# Altium project Kasli-DIOT.PrjPCB (part 3 of 7)

## Sheet PowerSupplies.SchDoc: Kasli-DIOT
size 420 x 297 mm; EDA_Number: ARTIQ; Projet: ARTIQ/SINARA; Author: G.Kasprowicz; CompanyName: WUT ISE; DrawnBy: F.Świtakowski; Organization: WUT ISE; Address1: PW ISE; Address2: Nowowiejska 15/19 00-665 Warsaw; Address3: gkasprow@gmail.com; DocumentNumber: 8; Revision: 1.0; SheetNumber: 8; SheetTotal: 16; ModifiedBy: -; CheckedDate: -; Title2: PowerSupplies; DivGrp: WUT ISE; Designer: F.Świtakowski; ModifiedDate: -; ProjectName: Sensor Box
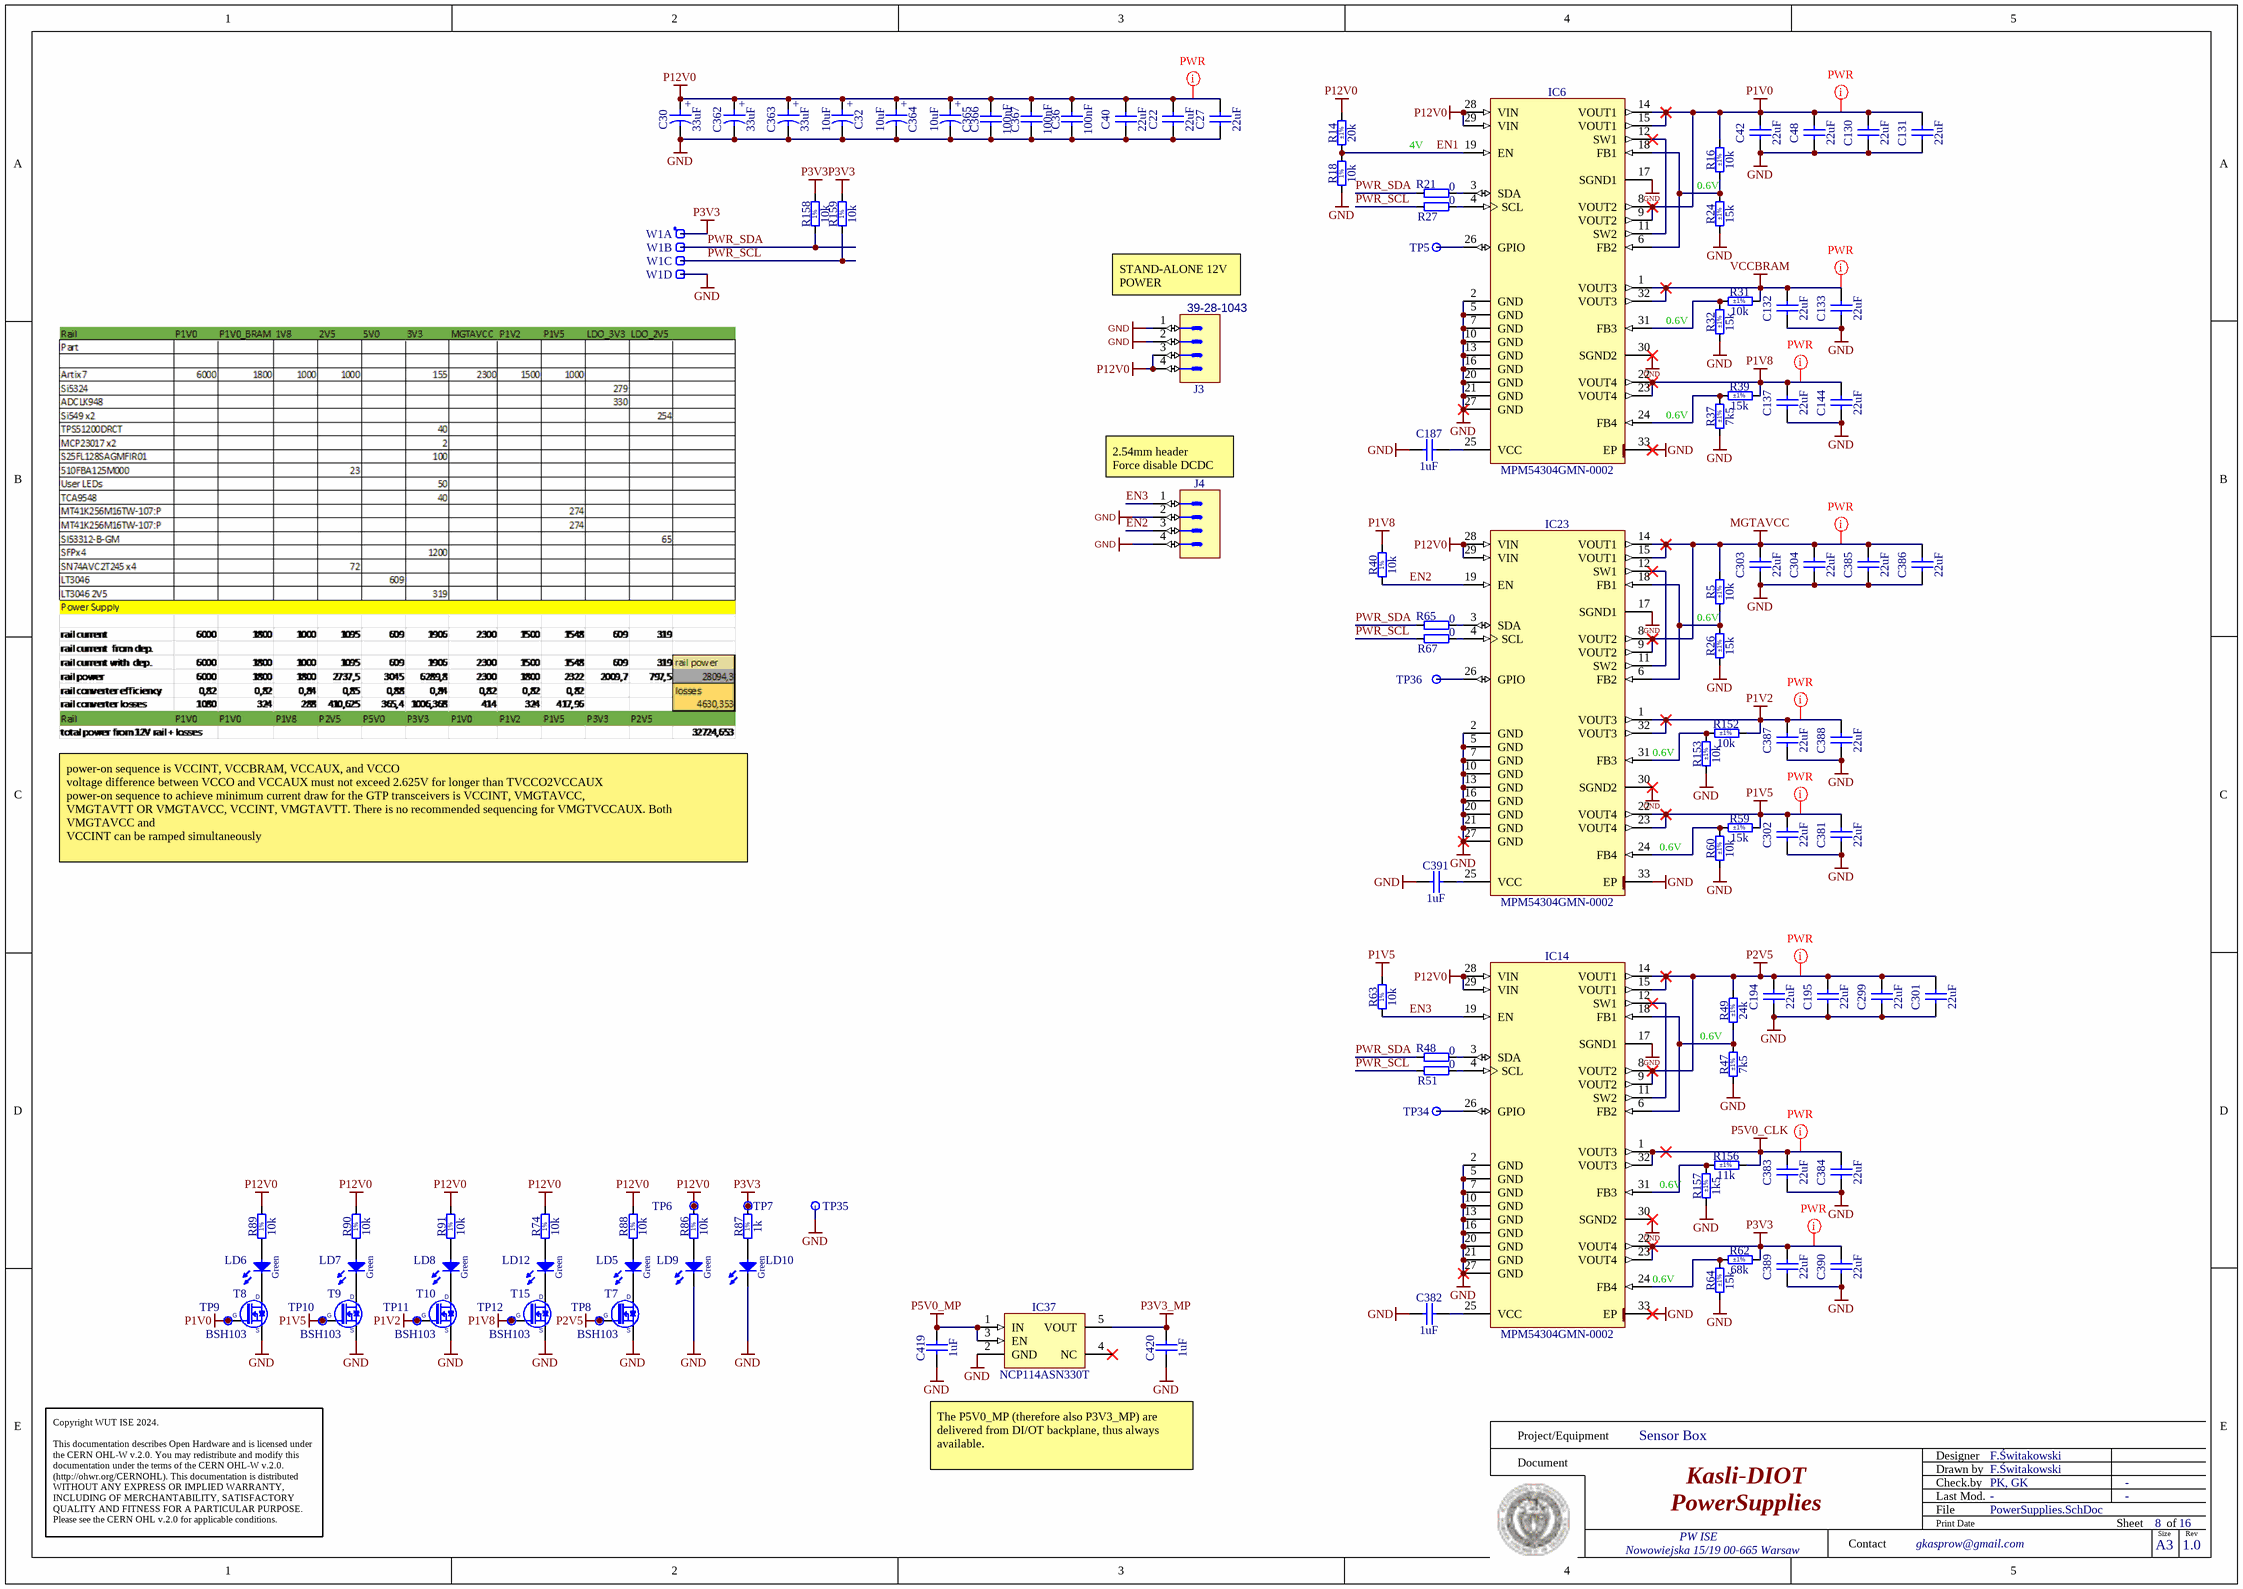
[diagram p2: PowerSupplies.SchDoc]

### Parts
C22  22uF  [CAPC2012X135N]
C27  22uF  [CAPC2012X135N]
C30  33uF  [CAPMP3528X210N]
C32  10uF  [CAPMP3216X180N]
C36  100nF  [CAPC1005X55N]
C40  22uF  [CAPC2012X135N]
C42  22uF  [CAPC2012X135N]
C48  22uF  [CAPC2012X135N]
C130  22uF  [CAPC2012X135N]
C131  22uF  [CAPC2012X135N]
C132  22uF  [CAPC2012X135N]
C133  22uF  [CAPC2012X135N]
C137  22uF  [CAPC2012X135N]
C144  22uF  [CAPC2012X135N]
C187  1uF  [CAPC1608X87N]
C194  22uF  [CAPC2012X135N]
C195  22uF  [CAPC2012X135N]
C299  22uF  [CAPC2012X135N]
C301  22uF  [CAPC2012X135N]
C302  22uF  [CAPC2012X135N]
C303  22uF  [CAPC2012X135N]
C304  22uF  [CAPC2012X135N]
C362  33uF  [CAPMP3528X210N]
C363  33uF  [CAPMP3528X210N]
C364  10uF  [CAPMP3216X180N]
C365  10uF  [CAPMP3216X180N]
C366  100nF  [CAPC1005X55N]
C367  100nF  [CAPC1005X55N]
C381  22uF  [CAPC2012X135N]
C382  1uF  [CAPC1608X87N]
C383  22uF  [CAPC2012X135N]
C384  22uF  [CAPC2012X135N]
C385  22uF  [CAPC2012X135N]
C386  22uF  [CAPC2012X135N]
C387  22uF  [CAPC2012X135N]
C388  22uF  [CAPC2012X135N]
C389  22uF  [CAPC2012X135N]
C390  22uF  [CAPC2012X135N]
C391  1uF  [CAPC1608X87N]
C419  1uF  [CAPC1608X87N]
C420  1uF  [CAPC1608X87N]
IC6  MPM54304GMN-0002  [MPS_MPM54304GMN]
IC14  MPM54304GMN-0002  [MPS_MPM54304GMN]
IC23  MPM54304GMN-0002  [MPS_MPM54304GMN]
IC37  NCP114ASN330T  [SOT95P280X100-5N]
J3  Manufacturer Part Number: 39-28-1043  [MOLEX_39-28-1043]  (hidden comment: Mini-Fit Jr.™)
J4  Header 2  [SAMTEC_TSM-102-01-L-DV]  (value not drawn)
LD5  Green  [LED_KINGBRIGHT_KPH-1608CGCK]
LD6  Green  [LED_KINGBRIGHT_KPH-1608CGCK]
LD7  Green  [LED_KINGBRIGHT_KPH-1608CGCK]
LD8  Green  [LED_KINGBRIGHT_KPH-1608CGCK]
LD9  Green  [LED_KINGBRIGHT_KPH-1608CGCK]
LD10  Green  [LED_KINGBRIGHT_KPH-1608CGCK]
LD12  Green  [LED_KINGBRIGHT_KPH-1608CGCK]
R5  10k  Tolerance: ±1%  [RESC1005X40N]
R14  20k  Tolerance: ±1%  [RESC1005X40N]
R16  10k  Tolerance: ±1%  [RESC1005X40N]
R18  10k  [RESC1005X40N]
R21  0  [RESC1005X40N]
R24  15k  Tolerance: ±1%  [RESC1005X40N]
R26  15k  Tolerance: ±1%  [RESC1005X40N]
R27  0  [RESC1005X40N]
R31  10k  Tolerance: ±1%  [RESC1005X40N]
R32  15k  Tolerance: ±1%  [RESC1005X40N]
R37  7k5  Tolerance: ±1%  [RESC1005X40N]
R39  15k  Tolerance: ±1%  [RESC1005X40N]
R40  10k  [RESC1005X40N]
R47  7k5  Tolerance: ±1%  [RESC1005X40N]
R48  0  [RESC1005X40N]
R49  24k  Tolerance: ±1%  [RESC1005X40N]
R51  0  [RESC1005X40N]
R59  15k  Tolerance: ±1%  [RESC1005X40N]
R60  10k  Tolerance: ±1%  [RESC1005X40N]
R62  68k  Tolerance: ±1%  [RESC1005X40N]
R63  10k  [RESC1005X40N]
R64  15k  Tolerance: ±1%  [RESC1005X40N]
R65  0  [RESC1005X40N]
R67  0  [RESC1005X40N]
R74  10k  [RESC1005X40N]
R86  10k  [RESC1005X40N]
R87  1k  [RESC1005X40N]
R88  10k  [RESC1005X40N]
R89  10k  [RESC1005X40N]
R90  10k  [RESC1005X40N]
R91  10k  [RESC1005X40N]
R152  10k  Tolerance: ±1%  [RESC1005X40N]
R153  10k  Tolerance: ±1%  [RESC1005X40N]
R156  11k  Tolerance: ±1%  [RESC1005X40N]
R157  1k5  Tolerance: ±1%  [RESC1005X40N]
R158  10k  [RESC1005X40N]
R159  10k  [RESC1005X40N]
T7  BSH103  [SOT95P230X110-3N]
T8  BSH103  [SOT95P230X110-3N]
T9  BSH103  [SOT95P230X110-3N]
T10  BSH103  [SOT95P230X110-3N]
T15  BSH103  [SOT95P230X110-3N]
TP5  Test Point  [TPS127]  (value not drawn)  (no BOM)
TP6  Test Point  [TPS127]  (value not drawn)  (no BOM)
TP7  Test Point  [TPS127]  (value not drawn)  (no BOM)
TP8  Test Point  [TPS127]  (value not drawn)  (no BOM)
TP9  Test Point  [TPS127]  (value not drawn)  (no BOM)
TP10  Test Point  [TPS127]  (value not drawn)  (no BOM)
TP11  Test Point  [TPS127]  (value not drawn)  (no BOM)
TP12  Test Point  [TPS127]  (value not drawn)  (no BOM)
TP34  Test Point  [TPS127]  (value not drawn)  (no BOM)
TP35  Plated Hole  [c170h100]  (value not drawn)  (no BOM)
TP36  Test Point  [TPS127]  (value not drawn)  (no BOM)
W1  Header 4  [SAMTEC_HTSW-104-23-L-S]  (value not drawn)  (parts A,B,C,D of 4)

### Nets
GND: C22.1 C27.1 C30.2 C32.2 C36.1 C40.1 C42.1 C48.1 C130.1 C131.1 C132.1 C133.1 C137.1 C144.1 C187.1 C194.1 C195.1 C299.1 C301.1 C302.1 C303.1 C304.1 C362.2 C363.2 C364.2 C365.2 C366.1 C367.1 C381.1 C382.1 C383.1 C384.1 C385.1 C386.1 C387.1 C388.1 C389.1 C390.1 C391.1 C419.1 C420.1 IC6.2(GND) IC6.5(GND) IC6.7(GND) IC6.10(GND) IC6.13(GND) IC6.16(GND) IC6.17(SGND1) IC6.20(GND) IC6.21(GND) IC6.27(GND) IC6.30(SGND2) IC6.33(EP) IC14.2(GND) IC14.5(GND) IC14.7(GND) IC14.10(GND) IC14.13(GND) IC14.16(GND) IC14.17(SGND1) IC14.20(GND) IC14.21(GND) IC14.27(GND) IC14.30(SGND2) IC14.33(EP) IC23.2(GND) IC23.5(GND) IC23.7(GND) IC23.10(GND) IC23.13(GND) IC23.16(GND) IC23.17(SGND1) IC23.20(GND) IC23.21(GND) IC23.27(GND) IC23.30(SGND2) IC23.33(EP) IC37.2(GND) J3.1 J3.2 J4.2 J4.4 LD9.1(C) LD10.1(C) R18.1 R24.1 R26.1 R32.1 R37.1 R47.1 R60.1 R64.1 R153.1 R157.1 T7.2(S) T8.2(S) T9.2(S) T10.2(S) T15.2(S) TP35.1 W1.4
MGTAVCC: C303.2 C304.2 C385.2 C386.2 IC23.8(VOUT2) IC23.9(VOUT2) IC23.14(VOUT1) IC23.15(VOUT1) R5.2
P1V0: C42.2 C48.2 C130.2 C131.2 IC6.8(VOUT2) IC6.9(VOUT2) IC6.14(VOUT1) IC6.15(VOUT1) R16.2 T8.1(G) TP9.1
P1V2: C387.2 C388.2 IC23.1(VOUT3) IC23.32(VOUT3) R152.2 T10.1(G) TP11.1
P1V5: C302.2 C381.2 IC23.22(VOUT4) IC23.23(VOUT4) R59.2 R63.2 T9.1(G) TP10.1
P1V8: C137.2 C144.2 IC6.22(VOUT4) IC6.23(VOUT4) R39.2 R40.2 T15.1(G) TP12.1
P2V5: C194.2 C195.2 C299.2 C301.2 IC14.8(VOUT2) IC14.9(VOUT2) IC14.14(VOUT1) IC14.15(VOUT1) R49.2 T7.1(G) TP8.1
P3V3: C389.2 C390.2 IC14.22(VOUT4) IC14.23(VOUT4) R62.2 R87.2 R158.2 R159.2 TP7.1 W1.1
P3V3_MP: C420.2 IC37.5(VOUT)
P5V0_CLK: C383.2 C384.2 IC14.1(VOUT3) IC14.32(VOUT3) R156.2
P5V0_MP: C419.2 IC37.1(IN) IC37.3(EN)
P12V0: C22.2 C27.2 C30.1 C32.1 C36.2 C40.2 C362.1 C363.1 C364.1 C365.1 C366.2 C367.2 IC6.28(VIN) IC6.29(VIN) IC14.28(VIN) IC14.29(VIN) IC23.28(VIN) IC23.29(VIN) J3.3 J3.4 R14.2 R74.2 R86.2 R88.2 R89.2 R90.2 R91.2 TP6.1
VCCBRAM: C132.2 C133.2 IC6.1(VOUT3) IC6.32(VOUT3) R31.2
EN1: IC6.19(EN) R14.1 R18.2
EN2: IC23.19(EN) J4.3 R40.1
EN3: IC14.19(EN) J4.1 R63.1
PWR_SCL: R27.1 R51.1 R67.1 R159.1 W1.3
PWR_SDA: R21.1 R48.1 R65.1 R158.1 W1.2
NetC187_2: C187.2 IC6.25(VCC)
NetC382_2: C382.2 IC14.25(VCC)
NetC391_2: C391.2 IC23.25(VCC)
NetIC6_3: IC6.3(SDA) R21.2
NetIC6_4: IC6.4(SCL) R27.2
NetIC6_6: IC6.6(FB2) IC6.18(FB1) R16.1 R24.2
NetIC6_11: IC6.11(SW2) IC6.12(SW1)
NetIC6_24: IC6.24(FB4) R37.2 R39.1
NetIC6_26: IC6.26(GPIO) TP5.1
NetIC6_31: IC6.31(FB3) R31.1 R32.2
NetIC14_3: IC14.3(SDA) R48.2
NetIC14_4: IC14.4(SCL) R51.2
NetIC14_6: IC14.6(FB2) IC14.18(FB1) R47.2 R49.1
NetIC14_11: IC14.11(SW2) IC14.12(SW1)
NetIC14_24: IC14.24(FB4) R62.1 R64.2
NetIC14_26: IC14.26(GPIO) TP34.1
NetIC14_31: IC14.31(FB3) R156.1 R157.2
NetIC23_3: IC23.3(SDA) R65.2
NetIC23_4: IC23.4(SCL) R67.2
NetIC23_6: IC23.6(FB2) IC23.18(FB1) R5.1 R26.2
NetIC23_11: IC23.11(SW2) IC23.12(SW1)
NetIC23_24: IC23.24(FB4) R59.1 R60.2
NetIC23_26: IC23.26(GPIO) TP36.1
NetIC23_31: IC23.31(FB3) R152.1 R153.2
NetLD5_1: LD5.1(C) T7.3(D)
NetLD5_2: LD5.2(A) R88.1
NetLD6_1: LD6.1(C) T8.3(D)
NetLD6_2: LD6.2(A) R89.1
NetLD7_1: LD7.1(C) T9.3(D)
NetLD7_2: LD7.2(A) R90.1
NetLD8_1: LD8.1(C) T10.3(D)
NetLD8_2: LD8.2(A) R91.1
NetLD9_2: LD9.2(A) R86.1
NetLD10_2: LD10.2(A) R87.1
NetLD12_1: LD12.1(C) T15.3(D)
NetLD12_2: LD12.2(A) R74.1

Not connected (* = marked no-connect by the designer): IC37 4(NC)*

### Layout directives
net class PWR: MGTAVCC, P1V0, P1V2, P1V5, P1V8, P2V5, P3V3, P5V0_CLK, P12V0, VCCBRAM

### Notes on the sheet
- 4V
- 0.6V
- (near J3) STAND-ALONE 12V POWER
- (near J4) 2.54mm header
  Force disable DCDC
- power-on sequence is VCCINT, VCCBRAM, VCCAUX, and VCCO
  voltage difference between VCCO and VCCAUX must not exceed 2.625V for longer than TVCCO2VCCAUX
  power-on sequence to achieve minimum current draw for the GTP transceivers is VCCINT, VMGTAVCC,
  VMGTAVTT OR VMGTAVCC, VCCINT, VMGTAVTT. There is no recommended sequencing for VMGTVCCAUX. Both VMGTAVCC and
  VCCINT can be ramped simultaneously
- (near IC14) 0.6V
- The P5V0_MP (therefore also P3V3_MP) are delivered from DI/OT backplane, thus always available.
- Project/Equipment
- Document
- Designer
- Drawn by
- Check.by
- Copyright WUT ISE 2024.
  This documentation describes Open Hardware and is licensed under the CERN OHL-W v.2.0. You may redistribute and modify this documentation under the terms of the CERN OHL-W v.2.0. (http://ohwr.org/CERNOHL). This documentation is distributed WITHOUT ANY EXPRESS OR IMPLIED WARRANTY, INCLUDING OF MERCHANTABILITY, SATISFACTORY QUALITY AND FITNESS FOR A PARTICULAR PURPOSE. Please see the CERN OHL v.2.0 for applicable conditions.
- Contact
- File
- Last Mod.
- Print Date
- Sheet
- Size
- A3
- of
- Rev
- (in symbol CTE3216-18_10UF_16V_20%_AVX_TCJ) +
- (in symbol CTE3528-21_33UF_16V_10%) +
- (in symbol R0402_1k_1%_0.0625W_100PPM) 1%
- (in symbol R0402_10k_1%_0.0625W_100PPM) 1%
- (in symbol R0402_10K_1%_0.0625W_100PPM) 1%

### Library data of the parts
C22 C27 C40 C42 C48 C130-C133 C137 C144 C194 C195 C299 C301-C304 C381 C383-C390 = CC0805_22UF_16V_10%_X5R: Non-polarised capacitor; Manufacturer: GENERIC; Part Description: SMD Multilayer Chip Ceramic Capacitor; Manufacturer1 Part Number: C2012X5R1C226KT; Tolerance: ±10%; Voltage: 16V; TC: X5R; Manufacturer Part Number: CC0805_22UF_16V_10%_X5R; Part Number: CC0805_22UF_16V_10%_X5R; Value: 22uF; Component Kind: Standard; Component Type: Standard; Pin Count: 2; Status: Preferred; Case: 0805; Mounted: Yes; Socket: No; SMD: Yes; Sense: No; Manufacturer1 Example: TDK; Manufacturer1 ComponentHeight: 1.35mm; HelpURL: \\cern.ch\dfs\Applications\Altium\Datasheets\CC0805_X5R_TDK_C.pdf; Author: CERN DEM JLC; CreateDate: 25.10.2012; LatestRevisionDate: 25.10.2012
C30 C362 C363 = CTE3528-21_33UF_16V_10%: Polarised capacitor; Part Description: Solid Tantalum Chip Capacitor; Manufacturer: GENERIC; Manufacturer1 Part Number: TAJB336K016R; Voltage: 16V; Tolerance: ±10%; Part Number: CTE3528-21_33UF_16V_10%; Component Kind: Standard; Component Type: Standard; Pin Count: 2; Value: 33uF; Status: Preferred; Manufacturer Part Number: CTE3528-21_33UF_16V_10%; Case: B; Mounted: Yes; Socket: No; SMD: Yes; Sense: No; HelpURL: \\cern.ch\dfs\Applications\Altium\Datasheets\CTE_AVX_TAJ.pdf; Author: CERN DEM JLC; CreateDate: 03.12.2007; LatestRevisionDate: 03.12.2007; Manufacturer1 Example: AVX; Manufacturer1 ComponentHeight: 2.1mm
C32 C364 C365 = CTE3216-18_10UF_16V_20%_AVX_TCJ: Polarised capacitor; Part Description: ESR 0R200 Tantalum Solid Electrolytic Chip Capacitor with Conductive Polymer Electrode; Manufacturer: AVX; Manufacturer Part Number: TCJA106M016R0200; Voltage: 16V; Tolerance: ±20%; Part Number: CTE3216-18_10UF_16V_20%_AVX_TCJ; Component Kind: Standard; Component Type: Standard; Pin Count: 2; Value: 10uF; Status: Preferred; Case: A; Mounted: Yes; Socket: No; SMD: Yes; Sense: No; ComponentHeight: 1.8mm; HelpURL: \\cern.ch\dfs\Applications\Altium\Datasheets\CTE_AVX_TCJ.pdf; Author: CERN DEM JLC; CreateDate: 29.03.2012; LatestRevisionDate: 29.03.2012
C36 C366 C367 = CC0402_100NF_16V_10%_X7R: as C161 on sheet Kasli-DIOT; Part Number: CC0402_100NF_16V_10%_X7R; Component Kind: Standard; Component Type: Standard; Pin Count: 2; Value: 100nF; Status: Not Recommended; Manufacturer Part Number: CC0402_100NF_16V_10%_X7R; Case: 0402; Mounted: Yes; Socket: No; SMD: Yes; Sense: No; Manufacturer1 Example: MURATA; Manufacturer1 ComponentHeight: 0.55mm; HelpURL: \\cern.ch\dfs\Applications\Altium\Datasheets\CC0402_X7R_MURATA_GRM.pdf; Author: CERN DEM JLC; CreateDate: 05/12/2013; LatestRevisionDate: 03/12/2007
C187 C382 C391 C419 C420 = CC0603_1UF_25V_10%_X7R: Non-polarised capacitor; Part Description: SMD Multilayer Chip Ceramic Capacitor; Manufacturer: GENERIC; Manufacturer1 Part Number: GRM188R71E105KA12D; Voltage: 25V; TC: X7R; Tolerance: ±10%; Part Number: CC0603_1UF_25V_10%_X7R; Component Kind: Standard; Component Type: Standard; Pin Count: 2; Value: 1uF; Status: None; Manufacturer Part Number: CC0603_1UF_25V_10%_X7R; Case: 0603; Mounted: Yes; Socket: No; SMD: Yes; Sense: No; Manufacturer1 Example: MURATA; Manufacturer1 ComponentHeight: 0.9mm; HelpURL: \\cern.ch\dfs\Applications\Altium\Datasheets\CC0603_X7R_MURATA.pdf; Author: CERN DEM JLC; CreateDate: 18.01.2011; LatestRevisionDate: 18.01.2011
IC6 IC14 IC23 = MPM54304GMN-XXXX: Quad-Output Power Module with I2C and MTP; Part Description: 4V to 16V Input, Quad-Output Power Module with I2C and MTP; Manufacturer: MPS (MONOLITIC  POWER SYSTEMS); Manufacturer Part Number: MPM54304GMN-002; PressFit: No; Bonding: No; Part Number: MPM54304GMN-0002; Component Kind: Standard; Component Type: Standard; Device: MPM54304GMN-0002; PackageDescription: MPS LGA-33 Case, 0.65mm Pitch, Rect.; 32 Pin, 7.00mm L X 7.00mm W X 2.10mm H body (w/Thermal Tab 3.55 X 3.55mm); Pin Count: 33; Case: QFN32; Mounted: Yes; Socket: No; SMD: Yes; Sense: No; ComponentHeight: 2.1mm; HelpURL: \\cern.ch\dfs\Applications\Altium\Datasheets\MPM54304GMN.pdf; Author: CERN DEM BC; CreateDate: 09.11.2020; LatestRevisionDate: 23.11.2022
IC37 = NCP114ASN330T: 3.3V 300mA Voltage Regulator - CMOS Low Dropout; Manufacturer: ON SEMICONDUCTOR; PressFit: No; Bonding: No; Part Number: NCP114ASN330T; Component Kind: Standard; Component Type: Standard; Device: NCP114ASN330T; PackageDescription: SOT23, 0.95mm Pitch; 5 Pin, 1.60mm W X 2.90mm L X 1.00mm H body, IPC Medium Density; Part Description: 3.3V 300mA Voltage Regulator - CMOS Low Dropout; Manufacturer Part Number: NCP114ASN330T; Pin Count: 5; Case: SOT23-5; Mounted: Yes; Socket: No; SMD: Yes; Sense: No; ComponentHeight: 1mm; HelpURL: \\cern.ch\dfs\Applications\Altium\Datasheets\NCP114ASN330T.pdf; Author: CERN DEM HF; CreateDate: 20.10.2023; LatestRevisionDate: 20.10.2023
J3 = MOLEX_39-28-1043: Connector 4 Male; Manufacturer: MOLEX; Part Description: 4.20mm (.165") Pitch Mini-Fit Jr.™ Header, Dual Row, Vertical, without Snap-in Plastic Peg PCB Lock, 4 Circuits; PressFit: No; Part Number: MOLEX_39-28-1043; Component Kind: Standard; Component Type: Standard; Pin Count: 4; Family: Mini-Fit Jr.™; Mounted: Yes; Socket: No; SMD: No; Sense: No; Status: None; ComponentHeight: 13.1mm; HelpURL: \\cern.ch\dfs\Applications\Altium\Datasheets\MOLEX_39-28-1043.pdf; Author: CERN DEM JLC; CreateDate: 12.03.2009; LatestRevisionDate: 06.03.2012
J4 = SAMTEC_TSM-102-01-L-DV: Connector 4 Male; Part Description: 2 Contacts, Pitch 2.54mm, Dual Row Surface Mount Straight Header (Post Lead 5.84mm); Manufacturer: SAMTEC; PressFit: No; Part Number: SAMTEC_TSM-102-01-L-DV; Component Kind: Standard; Component Type: Standard; Pin Count: 4; Family: Header 2; Mounted: Yes; Socket: No; SMD: Yes; Sense: No; Status: None; Manufacturer Part Number: TSM-102-01-L-DV; ComponentHeight: 9.65mm; HelpURL: \\cern.ch\dfs\Applications\Altium\Datasheets\SAMTEC_TSM-102-01-L-DV.pdf; Author: CERN DEM MR; CreateDate: 28.11.2017; LatestRevisionDate: 28.11.2017
LD5-LD10 LD12 = LED_KINGBRIGHT_KPH-1608CGCK: LED Green 1C 2A; Part Description: SMD Green LED, Case 1.6mmX0.8mm(0603), 0.65mm Thickness; PressFit: No; Bonding: No; Manufacturer Part Number: KPH-1608CGCK; ComponentHeight: 0.65mm; HelpURL: \\cern.ch\dfs\Applications\Altium\Datasheets\LED_KINGBRIGHT_KPH-1608CGCK.pdf; Part Number: LED_KINGBRIGHT_KPH-1608CGCK; Component Kind: Standard; Component Type: Standard; Color: Green; PackageDescription: SMT Green LED, Case 0603, Body L 1.6 x W 0.8mm H 0.65mm; Manufacturer: KINGBRIGHT; Pin Count: 2; Mounted: Yes; Socket: No; SMD: Yes; Sense: No; Author: CERN DEM JLC; CreateDate: 03.07.2017; LatestRevisionDate: 03.07.2017
R5 R16 R18 R31 R40 R60 R63 R152 R153 R158 R159 = R0402_10K_1%_0.0625W_100PPM: as R139 on sheet Kasli-DIOT; Part Number: R0402_10K_1%_0.0625W_100PPM; Component Kind: Standard; Component Type: Standard; Pin Count: 2; Value: 10k; Status: Not Recommended; Power: 0.0625W; Manufacturer Part Number: R0402_10K_1%_0.0625W_100PPM; Case: 0402; Mounted: Yes; Sense: No; Socket: No; SMD: Yes; Manufacturer1 Example: YAGEO PHYCOMP; Manufacturer1 ComponentHeight: 0.4mm; HelpURL: \\cern.ch\dfs\Applications\Altium\Datasheets\R0402_Phycomp_RC0402.pdf; Author: CERN DEM JLC; CreateDate: 03.12.2007; LatestRevisionDate: 17.10.2012
  R18 R40 R63 R158 R159: Tolerance: ±1%
R14 = R0402_20K_1%_0.0625W_100PPM: Resistor - 1%; Part Description: General Purpose Thick Film Chip Resistor; Manufacturer: GENERIC; Manufacturer1 Part Number: 232270672003L; TC: ±100ppm/°C; PressFit: No; Part Number: R0402_20K_1%_0.0625W_100PPM; Component Kind: Standard; Component Type: Standard; Pin Count: 2; Value: 20k; Status: Not Recommended; Power: 0.0625W; Manufacturer Part Number: R0402_20K_1%_0.0625W_100PPM; Case: 0402; Mounted: Yes; Sense: No; Socket: No; SMD: Yes; Manufacturer1 Example: YAGEO PHYCOMP; Manufacturer1 ComponentHeight: 0.4mm; HelpURL: \\cern.ch\dfs\Applications\Altium\Datasheets\R0402_Phycomp_RC0402.pdf; Author: CERN DEM JLC; CreateDate: 03.12.2007; LatestRevisionDate: 17.10.2012
R21 R27 R48 R51 R65 R67 = R0402_0R_JUMPER: Resistor; Part Description: 1A (0.05R Max DC Resistance) Zero Ohm Jumper; Manufacturer: GENERIC; Manufacturer1 Part Number: 232270591001L; PressFit: No; Part Number: R0402_0R_JUMPER; Component Kind: Standard; Component Type: Standard; Pin Count: 2; Value: 0; Status: Not Recommended; Manufacturer Part Number: R0402_0R_JUMPER; Case: 0402; Mounted: Yes; Sense: No; Socket: No; SMD: Yes; Manufacturer1 Example: YAGEO PHYCOMP; Manufacturer1 ComponentHeight: 0.4mm; HelpURL: \\cern.ch\dfs\Applications\Altium\Datasheets\R0402_Phycomp_RC0402.pdf; Author: CERN DEM JLC; CreateDate: 03.12.2007; LatestRevisionDate: 17.10.2012
R24 R26 R32 R39 R59 R64 = R0402_15K_1%_0.0625W_100PPM: Resistor - 1%; Part Description: General Purpose Thick Film Chip Resistor; Manufacturer: GENERIC; Manufacturer1 Part Number: CRCW040215K0FK; TC: ±100ppm/°C; PressFit: No; Part Number: R0402_15K_1%_0.0625W_100PPM; Component Kind: Standard; Component Type: Standard; Pin Count: 2; Value: 15k; Status: Preferred; Power: 0.0625W; Manufacturer Part Number: R0402_15K_1%_0.0625W_100PPM; Case: 0402; Mounted: Yes; Sense: No; Socket: No; SMD: Yes; Manufacturer1 Example: VISHAY; Manufacturer1 ComponentHeight: 0.4mm; HelpURL: \\cern.ch\dfs\Applications\Altium\Datasheets\R0402_VISHAY_CRCW e3.pdf; Author: CERN DEM JMW; CreateDate: 06.07.2015; LatestRevisionDate: 06.07.2015
R37 R47 = R0402_7K5_1%_0.0625W_100PPM: Resistor - 1%; Part Description: General Purpose Thick Film Chip Resistor; Manufacturer: GENERIC; Manufacturer1 Part Number: 232270677502L; TC: ±100ppm/°C; PressFit: No; Part Number: R0402_7K5_1%_0.0625W_100PPM; Component Kind: Standard; Component Type: Standard; Pin Count: 2; Value: 7k5; Status: Not Recommended; Power: 0.0625W; Manufacturer Part Number: R0402_7K5_1%_0.0625W_100PPM; Case: 0402; Mounted: Yes; Sense: No; Socket: No; SMD: Yes; Manufacturer1 Example: YAGEO PHYCOMP; Manufacturer1 ComponentHeight: 0.4mm; HelpURL: \\cern.ch\dfs\Applications\Altium\Datasheets\R0402_Phycomp_RC0402.pdf; Author: CERN DEM JLC; CreateDate: 03.12.2007; LatestRevisionDate: 17.10.2012
R49 = R0402_24K_1%_0.0625W_100PPM: Resistor - 1%; Part Description: General Purpose Thick Film Chip Resistor; Manufacturer: GENERIC; Manufacturer1 Part Number: 232270672403L; TC: ±100ppm/°C; PressFit: No; Part Number: R0402_24K_1%_0.0625W_100PPM; Component Kind: Standard; Component Type: Standard; Pin Count: 2; Value: 24k; Status: Not Recommended; Power: 0.0625W; Manufacturer Part Number: R0402_24K_1%_0.0625W_100PPM; Case: 0402; Mounted: Yes; Sense: No; Socket: No; SMD: Yes; Manufacturer1 Example: YAGEO PHYCOMP; Manufacturer1 ComponentHeight: 0.4mm; HelpURL: \\cern.ch\dfs\Applications\Altium\Datasheets\R0402_Phycomp_RC0402.pdf; Author: CERN DEM JLC; CreateDate: 03.12.2007; LatestRevisionDate: 17.10.2012
R62 = R0402_68K_1%_0.0625W_100PPM: Resistor - 1%; Part Description: General Purpose Thick Film Chip Resistor; Manufacturer: GENERIC; Manufacturer1 Part Number: 232270676803L; TC: ±100ppm/°C; PressFit: No; Part Number: R0402_68K_1%_0.0625W_100PPM; Component Kind: Standard; Component Type: Standard; Pin Count: 2; Value: 68k; Status: Not Recommended; Power: 0.0625W; Manufacturer Part Number: R0402_68K_1%_0.0625W_100PPM; Case: 0402; Mounted: Yes; Sense: No; Socket: No; SMD: Yes; Manufacturer1 Example: YAGEO PHYCOMP; Manufacturer1 ComponentHeight: 0.4mm; HelpURL: \\cern.ch\dfs\Applications\Altium\Datasheets\R0402_Phycomp_RC0402.pdf; Author: CERN DEM JLC; CreateDate: 03.12.2007; LatestRevisionDate: 17.10.2012
R74 R86 R88-R91 = R0402_10k_1%_0.0625W_100PPM: Resistor - 1%; Part Description: General Purpose Thick Film Chip Resistor; Manufacturer: GENERIC; Manufacturer1 Part Number: 232270671003L; TC: ±100ppm/°C; PressFit: No; Part Number: R0402_10K_1%_0.0625W_100PPM; Component Kind: Standard; Component Type: Standard; Pin Count: 2; Value: 10k; Status: Not Recommended; Power: 0.0625W; Tolerance: ±1%; Manufacturer Part Number: R0402_10K_1%_0.0625W_100PPM; Case: 0402; Mounted: Yes; Sense: No; Socket: No; SMD: Yes; Manufacturer1 Example: YAGEO PHYCOMP; Manufacturer1 ComponentHeight: 0.4mm; HelpURL: \\cern.ch\dfs\Applications\Altium\Datasheets\R0402_Phycomp_RC0402.pdf; Author: CERN DEM JLC; CreateDate: 03.12.2007; LatestRevisionDate: 17.10.2012
R87 = R0402_1k_1%_0.0625W_100PPM: Resistor - 1%; Part Description: General Purpose Thick Film Chip Resistor; Manufacturer: GENERIC; Manufacturer1 Part Number: 232270671002L; TC: ±100ppm/°C; PressFit: No; Part Number: R0402_1K_1%_0.0625W_100PPM; Component Kind: Standard; Component Type: Standard; Pin Count: 2; Value: 1k; Status: Not Recommended; Power: 0.0625W; Tolerance: ±1%; Manufacturer Part Number: R0402_1K_1%_0.0625W_100PPM; Case: 0402; Mounted: Yes; Sense: No; Socket: No; SMD: Yes; Manufacturer1 Example: YAGEO PHYCOMP; Manufacturer1 ComponentHeight: 0.4mm; HelpURL: \\cern.ch\dfs\Applications\Altium\Datasheets\R0402_Phycomp_RC0402.pdf; Author: CERN DEM JLC; CreateDate: 03.12.2007; LatestRevisionDate: 17.10.2012
R156 = R0402_11K_1%_0.0625W_100PPM: Resistor - 1%; Part Description: General Purpose Thick Film Chip Resistor; Manufacturer: GENERIC; Manufacturer1 Part Number: 232270671103L; TC: ±100ppm/°C; PressFit: No; Part Number: R0402_11K_1%_0.0625W_100PPM; Component Kind: Standard; Component Type: Standard; Pin Count: 2; Value: 11k; Status: Not Recommended; Power: 0.0625W; Manufacturer Part Number: R0402_11K_1%_0.0625W_100PPM; Case: 0402; Mounted: Yes; Sense: No; Socket: No; SMD: Yes; Manufacturer1 Example: YAGEO PHYCOMP; Manufacturer1 ComponentHeight: 0.4mm; HelpURL: \\cern.ch\dfs\Applications\Altium\Datasheets\R0402_Phycomp_RC0402.pdf; Author: CERN DEM JLC; CreateDate: 03.12.2007; LatestRevisionDate: 17.10.2012
R157 = R0402_1K5_1%_0.0625W_100PPM: Resistor - 1%; Part Description: General Purpose Thick Film Chip Resistor; Manufacturer: GENERIC; Manufacturer1 Part Number: 232270671502L; TC: ±100ppm/°C; PressFit: No; Part Number: R0402_1K5_1%_0.0625W_100PPM; Component Kind: Standard; Component Type: Standard; Pin Count: 2; Value: 1k5; Status: Not Recommended; Power: 0.0625W; Manufacturer Part Number: R0402_1K5_1%_0.0625W_100PPM; Case: 0402; Mounted: Yes; Sense: No; Socket: No; SMD: Yes; Manufacturer1 Example: YAGEO PHYCOMP; Manufacturer1 ComponentHeight: 0.4mm; HelpURL: \\cern.ch\dfs\Applications\Altium\Datasheets\R0402_Phycomp_RC0402.pdf; Author: CERN DEM JLC; CreateDate: 03.12.2007; LatestRevisionDate: 17.10.2012
T7-T10 T15 = BSH103: as T1 on sheet ClockRecovery; Part Number: BSH103; Component Kind: Standard; Component Type: Standard; Device: BSH103; PackageDescription: SOT23, 3 pin, Pitch 0.95mm - 1.3mm W X 2.9mm L X 1.1mm H, IPC Medium Density; Manufacturer Part Number: BSH103; Pin Count: 3; Case: SOT23-3; Mounted: Yes; Socket: No; SMD: Yes; Sense: No; ComponentHeight: 1.1mm; HelpURL: \\cern.ch\dfs\Applications\Altium\Datasheets\BSH103.pdf; Author: CERN DEM JLC; CreateDate: 16.03.2010; LatestRevisionDate: 20.06.2017
TP5-TP12 TP34 TP36 = SMD_PAD_1.27X1.27MM: Part Description: 1.27mm x 1.27mm PCB Copper Area (SMD Test Point); Mounted: No; Part Number: SMD_PAD_1.27X1.27MM; Component Type: Standard (No BOM); Pin Count: 1; Family: Test Point; Socket: No; SMD: Yes; Sense: No; Status: None; ComponentHeight: 0mm; HelpURL: Undefined; Author: CERN DEM JLC; CreateDate: 12.01.2008; LatestRevisionDate: 12.01.2008; PackageDescription: 1.27mm x 1.27mm PCB Copper Area (SMD Test Point)
TP35 = PLATED_HOLE1.0_PAD1.7: Single Terminal Socket; Part Description: Plated Through Hole: Hole Dia.=1.0mm Pad Dia.=1.7mm,  IPC-7251 Level A; Mounted: No; Part Number: PLATED_HOLE1.0_PAD1.7; Component Type: Standard (No BOM); Pin Count: 1; Family: Plated Hole; Socket: No; SMD: No; Sense: No; Status: None; ComponentHeight: 0mm; HelpURL: Undefined; Author: CERN DEM JLC; CreateDate: 11.05.2017; LatestRevisionDate: 11.05.2017; PackageDescription: Plated Through Hole: Hole Dia.=1.0mm Pad Dia.=1.7mm,  IPC-7251 Level A
W1 = SAMTEC_HTSW-104-23-L-S: 4 Mini Wire-Wrap Contact Strip Header; Part Description: 4 Contacts, Pitch 2.54mm, Single Row  Through Mount Straight Header (Post Lead 5.84mm, Tail Lead 2.92mm, Insulator 2.54mm); Manufacturer: SAMTEC; PressFit: No; Status Comment: High Temperature; Part Number: SAMTEC_HTSW-104-23-L-S; Component Kind: Standard; Component Type: Standard; Pin Count: 4; Family: Header 4; Mounted: Yes; Socket: No; Sense: No; SMD: No; Status: Preferred; Manufacturer Part Number: HTSW-104-23-L-S; ComponentHeight: 8.38mm; HelpURL: \\cern.ch\dfs\Applications\Altium\Datasheets\SAMTEC_HTSW-104-23-L-S.pdf; Author: CERN DEM JLC; CreateDate: 22/02/2018; LatestRevisionDate: 22/02/2018

## Sheet SFP.SchDoc: Kasli-DIOT
size 420 x 297 mm; EDA_Number: ARTIQ; Projet: ARTIQ/SINARA; Author: G.Kasprowicz; CompanyName: WUT ISE; DrawnBy: F.Świtakowski; Organization: WUT ISE; Address1: PW ISE; Address2: Nowowiejska 15/19 00-665 Warsaw; Address3: gkasprow@gmail.com; DocumentNumber: 5; Revision: 1.0; SheetNumber: 6; SheetTotal: 16; ModifiedBy: -; CheckedDate: -; Title2: SFP; DivGrp: WUT ISE; Designer: F.Świtakowski; ModifiedDate: -; ProjectName: Sensor Box
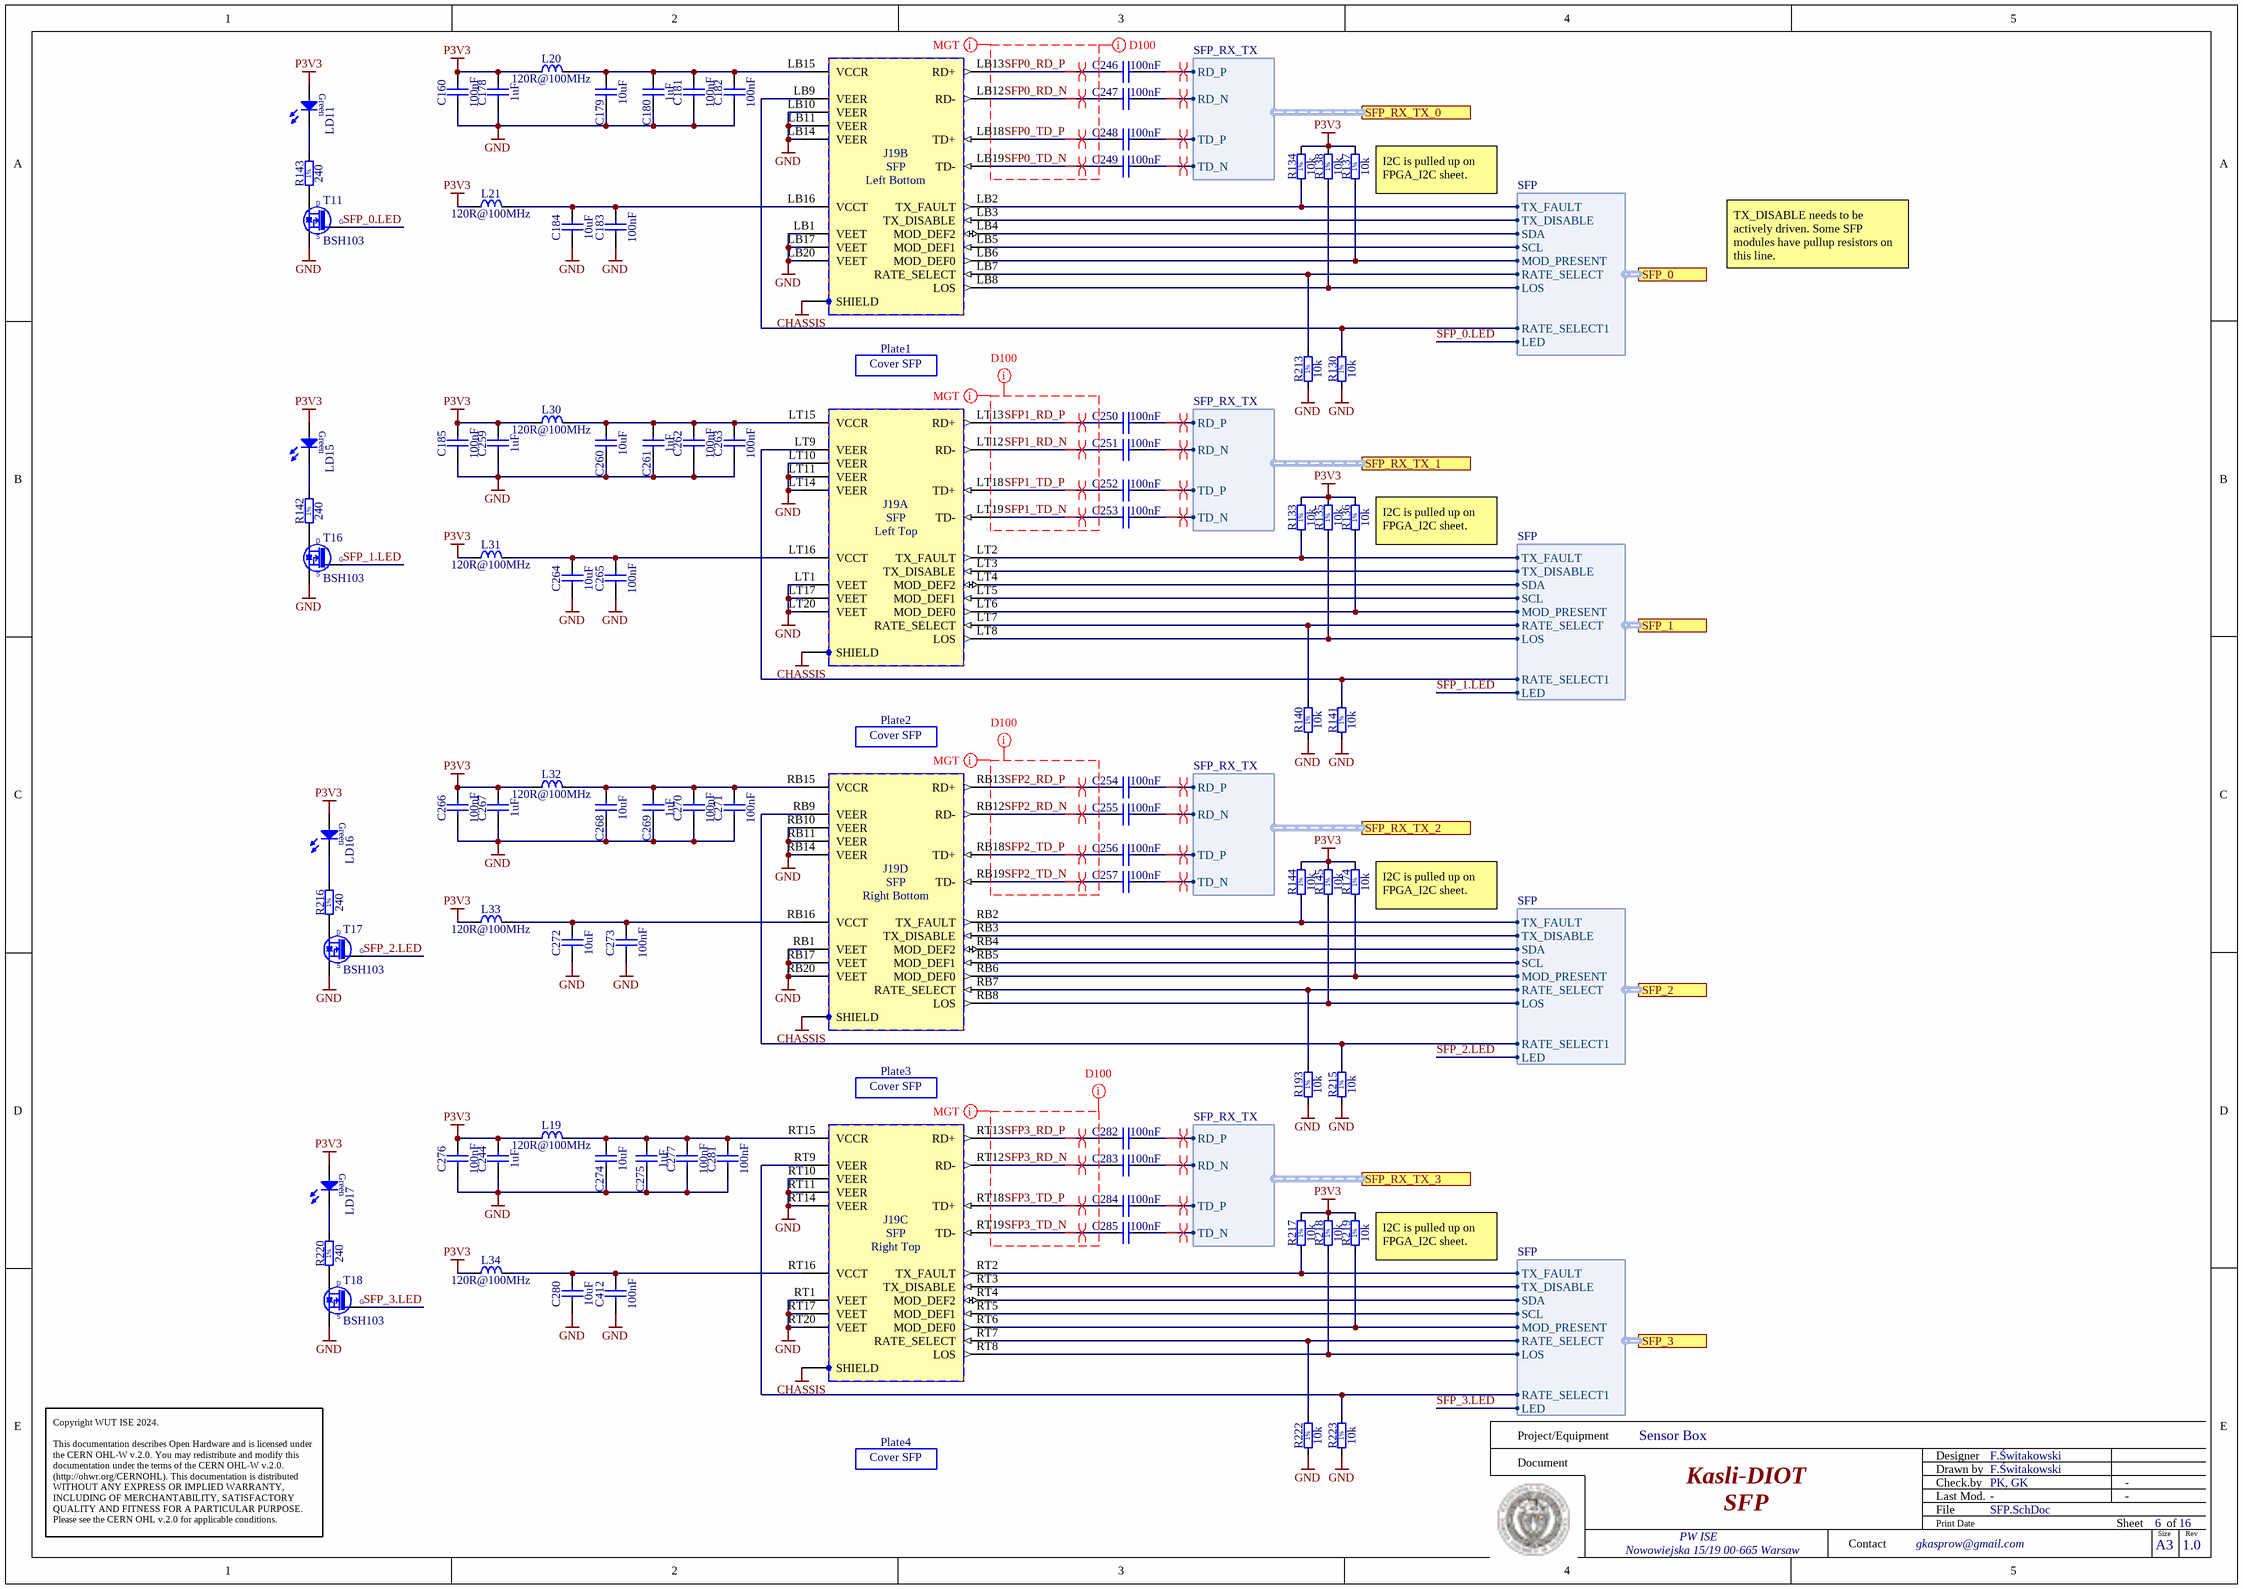
[diagram p3: SFP.SchDoc]

### Parts
C160  100nF  [CAPC1005X55N]
C178  1uF  [CAPC1005X55N]
C179  10uF  [CAPC2012X95N]
C180  1uF  [CAPC1005X55N]
C181  100nF  [CAPC1005X55N]
C182  100nF  [CAPC1005X55N]
C183  100nF  [CAPC1005X55N]
C184  10uF  [CAPC2012X95N]
C185  100nF  [CAPC1005X55N]
C244  1uF  [CAPC1005X55N]
C246  100nF  [CAPC0603X33N]
C247  100nF  [CAPC0603X33N]
C248  100nF  [CAPC0603X33N]
C249  100nF  [CAPC0603X33N]
C250  100nF  [CAPC0603X33N]
C251  100nF  [CAPC0603X33N]
C252  100nF  [CAPC0603X33N]
C253  100nF  [CAPC0603X33N]
C254  100nF  [CAPC0603X33N]
C255  100nF  [CAPC0603X33N]
C256  100nF  [CAPC0603X33N]
C257  100nF  [CAPC0603X33N]
C259  1uF  [CAPC1005X55N]
C260  10uF  [CAPC2012X95N]
C261  1uF  [CAPC1005X55N]
C262  100nF  [CAPC1005X55N]
C263  100nF  [CAPC1005X55N]
C264  10uF  [CAPC2012X95N]
C265  100nF  [CAPC1005X55N]
C266  100nF  [CAPC1005X55N]
C267  1uF  [CAPC1005X55N]
C268  10uF  [CAPC2012X95N]
C269  1uF  [CAPC1005X55N]
C270  100nF  [CAPC1005X55N]
C271  100nF  [CAPC1005X55N]
C272  10uF  [CAPC2012X95N]
C273  100nF  [CAPC1005X55N]
C274  10uF  [CAPC2012X95N]
C275  1uF  [CAPC1005X55N]
C276  100nF  [CAPC1005X55N]
C277  100nF  [CAPC1005X55N]
C280  10uF  [CAPC2012X95N]
C281  100nF  [CAPC1005X55N]
C282  100nF  [CAPC0603X33N]
C283  100nF  [CAPC0603X33N]
C284  100nF  [CAPC0603X33N]
C285  100nF  [CAPC0603X33N]
C412  100nF  [CAPC1005X55N]
J19  SFP  [AMPHENOL_UE78B212700321]  (parts A,B,C,D of 4)
L19  120R@100MHz  [INDC1608X65N]
L20  120R@100MHz  [INDC1608X65N]
L21  120R@100MHz  [INDC1608X65N]
L30  120R@100MHz  [INDC1608X65N]
L31  120R@100MHz  [INDC1608X65N]
L32  120R@100MHz  [INDC1608X65N]
L33  120R@100MHz  [INDC1608X65N]
L34  120R@100MHz  [INDC1608X65N]
LD11  Green  [LED_AVAGO_HSME-C120]  (value not drawn)
LD15  Green  [LED_AVAGO_HSME-C120]  (value not drawn)
LD16  Green  [LED_AVAGO_HSME-C120]  (value not drawn)
LD17  Green  [LED_AVAGO_HSME-C120]  (value not drawn)
Plate1  Cover SFP  [AMPHENOL_U77A11108000P]
Plate2  Cover SFP  [AMPHENOL_U77A11108000P]
Plate3  Cover SFP  [AMPHENOL_U77A11108000P]
Plate4  Cover SFP  [AMPHENOL_U77A11108000P]
R130  10k  [RESC1005X40N]
R133  10k  [RESC1005X40N]
R134  10k  [RESC1005X40N]
R135  10k  [RESC1005X40N]
R136  10k  [RESC1005X40N]
R137  10k  [RESC1005X40N]
R138  10k  [RESC1005X40N]
R140  10k  [RESC1005X40N]
R141  10k  [RESC1005X40N]
R142  240  [RESC1005X40N]
R143  240  [RESC1005X40N]
R144  10k  [RESC1005X40N]
R145  10k  [RESC1005X40N]
R174  10k  [RESC1005X40N]
R193  10k  [RESC1005X40N]
R213  10k  [RESC1005X40N]
R215  10k  [RESC1005X40N]
R216  240  [RESC1005X40N]
R217  10k  [RESC1005X40N]
R218  10k  [RESC1005X40N]
R219  10k  [RESC1005X40N]
R220  240  [RESC1005X40N]
R222  10k  [RESC1005X40N]
R223  10k  [RESC1005X40N]
T11  BSH103  [SOT95P230X110-3N]
T16  BSH103  [SOT95P230X110-3N]
T17  BSH103  [SOT95P230X110-3N]
T18  BSH103  [SOT95P230X110-3N]

### Ports
SFP_0 (harness SFP), SFP_1 (harness SFP), SFP_2 (harness SFP), SFP_3 (harness SFP), SFP_RX_TX_0 (harness SFP_RX_TX), SFP_RX_TX_1 (harness SFP_RX_TX), SFP_RX_TX_2 (harness SFP_RX_TX), SFP_RX_TX_3 (harness SFP_RX_TX)

### Harnesses
SFP_RX_TX: RD_P, RD_N, TD_P, TD_N
SFP: TX_FAULT, LOS, MOD_PRESENT, TX_DISABLE, RATE_SELECT, LED, RATE_SELECT1, SDA, SCL

### Nets
CHASSIS: J19.SHIELD  [project net STRIP3]
GND: C160.1 C178.1 C179.1 C180.1 C181.1 C182.1 C183.1 C184.1 C185.1 C244.1 C259.1 C260.1 C261.1 C262.1 C263.1 C264.1 C265.1 C266.1 C267.1 C268.1 C269.1 C270.1 C271.1 C272.1 C273.1 C274.1 C275.1 C276.1 C277.1 C280.1 C281.1 C412.1 J19.LB1(VEET) J19.LB10(VEER) J19.LB11(VEER) J19.LB14(VEER) J19.LB17(VEET) J19.LB20(VEET) J19.LT1(VEET) J19.LT10(VEER) J19.LT11(VEER) J19.LT14(VEER) J19.LT17(VEET) J19.LT20(VEET) J19.RB1(VEET) J19.RB10(VEER) J19.RB11(VEER) J19.RB14(VEER) J19.RB17(VEET) J19.RB20(VEET) J19.RT1(VEET) J19.RT10(VEER) J19.RT11(VEER) J19.RT14(VEER) J19.RT17(VEET) J19.RT20(VEET) R130.1 R140.1 R141.1 R193.1 R213.1 R215.1 R222.1 R223.1 T11.2(S) T16.2(S) T17.2(S) T18.2(S)
P3V3: C160.2 C178.2 C185.2 C244.2 C259.2 C266.2 C267.2 C276.2 L19.1 L20.1 L21.1 L30.1 L31.1 L32.1 L33.1 L34.1 LD11.2(A) LD15.2(A) LD16.2(A) LD17.2(A) R133.2 R134.2 R135.2 R136.2 R137.2 R138.2 R144.2 R145.2 R174.2 R217.2 R218.2 R219.2
SFP0_RD_N: C247.1 J19.LB12(RD-)
SFP0_RD_P: C246.1 J19.LB13(RD+)
SFP0_TD_N: C249.1 J19.LB19(TD-)
SFP0_TD_P: C248.1 J19.LB18(TD+)
SFP1_RD_N: C251.1 J19.LT12(RD-)
SFP1_RD_P: C250.1 J19.LT13(RD+)
SFP1_TD_N: C253.1 J19.LT19(TD-)
SFP1_TD_P: C252.1 J19.LT18(TD+)
SFP2_RD_N: C255.1 J19.RB12(RD-)
SFP2_RD_P: C254.1 J19.RB13(RD+)
SFP2_TD_N: C257.1 J19.RB19(TD-)
SFP2_TD_P: C256.1 J19.RB18(TD+)
SFP3_RD_N: C283.1 J19.RT12(RD-)
SFP3_RD_P: C282.1 J19.RT13(RD+)
SFP3_TD_N: C285.1 J19.RT19(TD-)
SFP3_TD_P: C284.1 J19.RT18(TD+)
SFP.RX0_N: C247.2 ; port SFP_RX_TX_0.RD_N
SFP.RX0_P: C246.2 ; port SFP_RX_TX_0.RD_P
SFP.RX1_N: C251.2 ; port SFP_RX_TX_1.RD_N
SFP.RX1_P: C250.2 ; port SFP_RX_TX_1.RD_P
SFP.RX2_N: C255.2 ; port SFP_RX_TX_2.RD_N
SFP.RX2_P: C254.2 ; port SFP_RX_TX_2.RD_P
SFP.RX3_N: C285.2 ; port SFP_RX_TX_3.TD_N
SFP.RX3_P: C284.2 ; port SFP_RX_TX_3.TD_P
SFP.TX0_N: C249.2 ; port SFP_RX_TX_0.TD_N
SFP.TX0_P: C248.2 ; port SFP_RX_TX_0.TD_P
SFP.TX1_N: C253.2 ; port SFP_RX_TX_1.TD_N
SFP.TX1_P: C252.2 ; port SFP_RX_TX_1.TD_P
SFP.TX2_N: C257.2 ; port SFP_RX_TX_2.TD_N
SFP.TX2_P: C256.2 ; port SFP_RX_TX_2.TD_P
SFP.TX3_N: C283.2 ; port SFP_RX_TX_3.RD_N
SFP.TX3_P: C282.2 ; port SFP_RX_TX_3.RD_P
SFP_0.LED: T11.1(G) ; port SFP_0.LED
SFP_0.LOS: J19.LB8(LOS) R138.1 ; port SFP_0.LOS
SFP_0.MOD_PRESENT: J19.LB6(MOD_DEF0) R137.1 ; port SFP_0.MOD_PRESENT
SFP_0.RATE_SELECT: J19.LB7(RATE_SELECT) R213.2 ; port SFP_0.RATE_SELECT
SFP_0.RATE_SELECT1: J19.LB9(VEER) R130.2 ; port SFP_0.RATE_SELECT1
SFP_0.SCL: J19.LB5(MOD_DEF1) ; port SFP_0.SCL
SFP_0.SDA: J19.LB4(MOD_DEF2) ; port SFP_0.SDA
SFP_0.TX_DISABLE: J19.LB3(TX_DISABLE) ; port SFP_0.TX_DISABLE
SFP_0.TX_FAULT: J19.LB2(TX_FAULT) R134.1 ; port SFP_0.TX_FAULT
SFP_1.LED: T16.1(G) ; port SFP_1.LED
SFP_1.LOS: J19.LT8(LOS) R135.1 ; port SFP_1.LOS
SFP_1.MOD_PRESENT: J19.LT6(MOD_DEF0) R136.1 ; port SFP_1.MOD_PRESENT
SFP_1.RATE_SELECT: J19.LT7(RATE_SELECT) R140.2 ; port SFP_1.RATE_SELECT
SFP_1.RATE_SELECT1: J19.LT9(VEER) R141.2 ; port SFP_1.RATE_SELECT1
SFP_1.SCL: J19.LT5(MOD_DEF1) ; port SFP_1.SCL
SFP_1.SDA: J19.LT4(MOD_DEF2) ; port SFP_1.SDA
SFP_1.TX_DISABLE: J19.LT3(TX_DISABLE) ; port SFP_1.TX_DISABLE
SFP_1.TX_FAULT: J19.LT2(TX_FAULT) R133.1 ; port SFP_1.TX_FAULT
SFP_2.LED: T17.1(G) ; port SFP_2.LED
SFP_2.LOS: J19.RB8(LOS) R145.1 ; port SFP_2.LOS
SFP_2.MOD_PRESENT: J19.RB6(MOD_DEF0) R174.1 ; port SFP_2.MOD_PRESENT
SFP_2.RATE_SELECT: J19.RB7(RATE_SELECT) R193.2 ; port SFP_2.RATE_SELECT
SFP_2.RATE_SELECT1: J19.RB9(VEER) R215.2 ; port SFP_2.RATE_SELECT1
SFP_2.SCL: J19.RB5(MOD_DEF1) ; port SFP_2.SCL
SFP_2.SDA: J19.RB4(MOD_DEF2) ; port SFP_2.SDA
SFP_2.TX_DISABLE: J19.RB3(TX_DISABLE) ; port SFP_2.TX_DISABLE
SFP_2.TX_FAULT: J19.RB2(TX_FAULT) R144.1 ; port SFP_2.TX_FAULT
SFP_3.LED: T18.1(G) ; port SFP_3.LED
SFP_3.LOS: J19.RT8(LOS) R218.1 ; port SFP_3.LOS
SFP_3.MOD_PRESENT: J19.RT6(MOD_DEF0) R219.1 ; port SFP_3.MOD_PRESENT
SFP_3.RATE_SELECT: J19.RT7(RATE_SELECT) R222.2 ; port SFP_3.RATE_SELECT
SFP_3.RATE_SELECT1: J19.RT9(VEER) R223.2 ; port SFP_3.RATE_SELECT1
SFP_3.SCL: J19.RT5(MOD_DEF1) ; port SFP_3.SCL
SFP_3.SDA: J19.RT4(MOD_DEF2) ; port SFP_3.SDA
SFP_3.TX_DISABLE: J19.RT3(TX_DISABLE) ; port SFP_3.TX_DISABLE
SFP_3.TX_FAULT: J19.RT2(TX_FAULT) R217.1 ; port SFP_3.TX_FAULT
NetC179_2: C179.2 C180.2 C181.2 C182.2 J19.LB15(VCCR) L20.2
NetC183_2: C183.2 C184.2 J19.LB16(VCCT) L21.2
NetC260_2: C260.2 C261.2 C262.2 C263.2 J19.LT15(VCCR) L30.2
NetC264_2: C264.2 C265.2 J19.LT16(VCCT) L31.2
NetC268_2: C268.2 C269.2 C270.2 C271.2 J19.RB15(VCCR) L32.2
NetC272_2: C272.2 C273.2 J19.RB16(VCCT) L33.2
NetC274_2: C274.2 C275.2 C277.2 C281.2 J19.RT15(VCCR) L19.2
NetC280_2: C280.2 C412.2 J19.RT16(VCCT) L34.2
NetLD11_1: LD11.1(C) R143.2
NetLD15_1: LD15.1(C) R142.2
NetLD16_1: LD16.1(C) R216.2
NetLD17_1: LD17.1(C) R220.2
NetR142_1: R142.1 T16.3(D)
NetR143_1: R143.1 T11.3(D)
NetR216_1: R216.1 T17.3(D)
NetR220_1: R220.1 T18.3(D)

### Layout directives
net class MGT: SFP0_RD_N, SFP0_RD_P, SFP0_TD_N, SFP0_TD_P, SFP1_RD_N, SFP1_RD_P, SFP1_TD_N, SFP1_TD_P, SFP2_RD_N, SFP2_RD_P, SFP2_TD_N, SFP2_TD_P, SFP3_RD_N, SFP3_RD_P, SFP3_TD_N, SFP3_TD_P
net class D100: SFP0_RD_N, SFP0_RD_P, SFP0_TD_N, SFP0_TD_P, SFP1_RD_N, SFP1_RD_P, SFP1_TD_N, SFP1_TD_P, SFP2_RD_N, SFP2_RD_P, SFP2_TD_N, SFP2_TD_P, SFP3_RD_N, SFP3_RD_P, SFP3_TD_N, SFP3_TD_P
differential pair: SFP0_RD_N, SFP0_RD_P, SFP0_TD_N, SFP0_TD_P, SFP1_RD_N, SFP1_RD_P, SFP1_TD_N, SFP1_TD_P, SFP2_RD_N, SFP2_RD_P, SFP2_TD_N, SFP2_TD_P, SFP3_RD_N, SFP3_RD_P, SFP3_TD_N, SFP3_TD_P, SFP.RX0_N, SFP.RX0_P, SFP.RX1_N, SFP.RX1_P, SFP.RX2_N, SFP.RX2_P, SFP.RX3_N, SFP.RX3_P, SFP.TX0_N, SFP.TX0_P, SFP.TX1_N, SFP.TX1_P, SFP.TX2_N, SFP.TX2_P, SFP.TX3_N, SFP.TX3_P

### Notes on the sheet
- (near R137) I2C is pulled up on FPGA_I2C sheet.
- TX_DISABLE needs to be actively driven. Some SFP modules have pullup resistors on this line.
- (near R136) I2C is pulled up on FPGA_I2C sheet.
- (near R174) I2C is pulled up on FPGA_I2C sheet.
- (near R219) I2C is pulled up on FPGA_I2C sheet.
- Project/Equipment
- Document
- Designer
- Drawn by
- Check.by
- Copyright WUT ISE 2024.
  This documentation describes Open Hardware and is licensed under the CERN OHL-W v.2.0. You may redistribute and modify this documentation under the terms of the CERN OHL-W v.2.0. (http://ohwr.org/CERNOHL). This documentation is distributed WITHOUT ANY EXPRESS OR IMPLIED WARRANTY, INCLUDING OF MERCHANTABILITY, SATISFACTORY QUALITY AND FITNESS FOR A PARTICULAR PURPOSE. Please see the CERN OHL v.2.0 for applicable conditions.
- Contact
- File
- Last Mod.
- Print Date
- Sheet
- Size
- A3
- of
- Rev
- (in symbol AMPHENOL_UE78B212700321, part A) Left Top
- (in symbol AMPHENOL_UE78B212700321, part B) Left Bottom
- (in symbol AMPHENOL_UE78B212700321, part C) Right Top
- (in symbol AMPHENOL_UE78B212700321, part D) Right Bottom
- (in symbol R0402_10K_1%_0.0625W_100PPM) 1%
- (in symbol R0402_240R_1%_0.0625W_100PPM) 1%

### Library data of the parts
C160 C181-C183 C185 C262 C263 C265 C266 C270 C271 C273 C276 C277 C281 C412 = CC0402_100NF_16V_10%_X7R: Non-polarised capacitor; Part Description: SMD Multilayer Chip Ceramic Capacitor; Manufacturer: GENERIC; Manufacturer1 Part Number: GRM155R71C104KA88D; Voltage: 16V; TC: X7R; Tolerance: ±10%; Part Number: CC0402_100NF_16V_10%_X7R; Component Kind: Standard; Component Type: Standard; Pin Count: 2; Value: 100nF; Status: Not Recommended; Manufacturer Part Number: CC0402_100NF_16V_10%_X7R; Case: 0402; Mounted: Yes; Socket: No; SMD: Yes; Sense: No; Manufacturer1 Example: MURATA; Manufacturer1 ComponentHeight: 0.55mm; HelpURL: \\cern.ch\dfs\Applications\Altium\Datasheets\CC0402_X7R_MURATA_GRM.pdf; Author: CERN DEM JLC; CreateDate: 05/12/2013; LatestRevisionDate: 03/12/2007
C178 C180 C244 C259 C261 C267 C269 C275 = CC0402_1UF_16V_10%_X5R: Non-polarised capacitor; Part Description: SMD Multilayer Chip Ceramic Capacitor; Manufacturer: GENERIC; Manufacturer1 Part Number: C1005X5R1C105KT; Voltage: 16V; TC: X5R; Tolerance: ±10%; Part Number: CC0402_1UF_16V_10%_X5R; Component Kind: Standard; Component Type: Standard; Pin Count: 2; Value: 1uF; Status: Preferred; Manufacturer Part Number: CC0402_1UF_16V_10%_X5R; Case: 0402; Mounted: Yes; Socket: No; SMD: Yes; Sense: No; Manufacturer1 Example: TDK; Manufacturer1 ComponentHeight: 0.55mm; HelpURL: \\cern.ch\dfs\Applications\Altium\Datasheets\CC0402_X5R_TDK_C.pdf; Author: CERN DEM JLC; CreateDate: 2012-10-25; LatestRevisionDate: 2012-10-25
C179 C184 C260 C264 C268 C272 C274 C280 = CC0805_10UF_25V_10%_X5R: Non-polarised capacitor; Part Description: SMD Multilayer Chip Ceramic Capacitor; Manufacturer: GENERIC; Manufacturer1 Part Number: GRM219R61E106KA12D; Voltage: 25V; TC: X5R; Tolerance: ±10%; Part Number: CC0805_10UF_25V_10%_X5R; Component Kind: Standard; Component Type: Standard; Pin Count: 2; Value: 10uF; Status: Preferred; Manufacturer Part Number: CC0805_10UF_25V_10%_X5R; Case: 0805; Mounted: Yes; Socket: No; SMD: Yes; Sense: No; Manufacturer1 Example: MURATA; Manufacturer1 ComponentHeight: 0.95mm; HelpURL: \\cern.ch\dfs\Applications\Altium\Datasheets\CC0805_X5R_MURATA_GRM.pdf; Author: CERN DEM JLC; CreateDate: 25.10.2012; LatestRevisionDate: 06.09.2016
C246-C257 C282-C285 = CC0201_100NF_6.3V_10%_X5R: Non-polarised capacitor; Part Description: SMD Multilayer Chip Ceramic Capacitor; Manufacturer: GENERIC; Manufacturer1 Part Number: 02016D104KAT2A; Voltage: 6.3V; TC: X5R; Tolerance: ±10%; Part Number: CC0201_100NF_6.3V_10%_X5R; Component Kind: Standard; Component Type: Standard; Pin Count: 2; Value: 100nF; Status: Not Recommended; Manufacturer Part Number: CC0201_100NF_6.3V_10%_X5R; Case: 0201; Mounted: Yes; Socket: No; SMD: Yes; Sense: No; Manufacturer1 Example: AVX; Manufacturer1 ComponentHeight: 0.33mm; HelpURL: \\cern.ch\dfs\Applications\Altium\Datasheets\CC0201_X5R_AVX.pdf; Author: CERN DEM JLC; CreateDate: 2007-12-03; LatestRevisionDate: 2007-12-03; ClassName: SATA
J19 = AMPHENOL_UE78B212700321: 20 Position SFP  Connector (Small Form-factor Pluggable); Part Description: 2x2 SFP Cage (Small Form-factor Pluggable) with 4x20 Positions Integrated Receptacles (Press Fit Tails); Part Number: AMPHENOL_UE78B212700321; Component Kind: Standard; Component Type: Standard; Pin Count: 110; Family: SFP; Mounted: Yes; Socket: No; SMD: No; PressFit: Yes; Sense: No; Status: None; Manufacturer: AMPHENOL; Manufacturer Part Number: UE78B212700321; ComponentHeight: 25.45mm; HelpURL: \\cern.ch\dfs\Applications\Altium\Datasheets\AMPHENOL_UE78B212700321.pdf; Author: CERN DEM BC; CreateDate: 25.10.2019; LatestRevisionDate: 25.10.2019
L19-L21 L30-L34 = IND0603_MURATA_BLM18SG121TN1D: Inductor; Part Description: SMD EMIFIL Suppression Chip Ferrite Bead; Manufacturer: MURATA; Power: 3A; Resistance: 0.025R; Tolerance: ±25%; Part Number: IND0603_MURATA_BLM18SG121TN1D; Component Kind: Standard; Component Type: Standard; Pin Count: 2; Value: 120R@100MHz; Status: None; Manufacturer Part Number: BLM18SG121TN1D; Case: 0603; Mounted: Yes; Socket: No; SMD: Yes; Sense: No; ComponentHeight: 0.65mm; HelpURL: \\cern.ch\dfs\Applications\Altium\Datasheets\IND0603_MURATA_BLM18S.pdf; Author: CERN DEM JLC; CreateDate: 23.07.2014; LatestRevisionDate: 23.07.2014
LD11 LD15-LD17 = LED_AVAGO_HSME-C120: LED Green 1C 2A; Part Description: High Performance Right Angle Chip Green LED; Manufacturer: AVAGO TECHNOLOGIES; PressFit: No; Bonding: No; Part Number: LED_AVAGO_HSME-C120; Component Kind: Standard; Component Type: Standard; Color: Green; PackageDescription: Green Chip LED, 2-Leads, Body 1.7x1.1mm, Side Emitting Package; Manufacturer Part Number: HSME-C120; Pin Count: 2; Mounted: Yes; Socket: No; SMD: Yes; Sense: No; ComponentHeight: 0.7mm; HelpURL: \\cern.ch\dfs\Applications\Altium\Datasheets\LED_AVAGO_HSME-C120.pdf; ComponentLink1URL: \\cern.ch\dfs\Applications\Altium\Datasheets\LED_AVAGO_HSME-C110_DESIGN-GUIDE.pdf; ComponentLink1Description: Design Guide; Author: CERN DEM JMW; CreateDate: 22.07.2009; LatestRevisionDate: 20.06.2012
Plate1-Plate4 = AMPHENOL_U77A11108000P: Plastic Dust Cover SFP Cage; PressFit: No; Part Number: AMPHENOL_U77A11108000P; Component Kind: Accessories; Component Type: Standard; Pin Count: 0; PackageDescription: Plastic Dust Cover SFP Cage; Mounted: Yes; Socket: No; SMD: No; Sense: No; Status: None; Value: Cover SFP; Part Description: Plastic Dust Cover SFP Cage; Manufacturer: AMPHENOL; Manufacturer Part Number: U77A11108000P; ComponentHeight: 10.2mm; HelpURL: \\cern.ch\dfs\Applications\Altium\Datasheets\AMPHENOL_U77A11108000P.pdf; Author: CERN DEM BC; CreateDate: 28.10.2019; LatestRevisionDate: 28.10.2019
R130 R133-R138 R140 R141 R144 R145 R174 R193 R213 R215 R217-R219 R222 R223 = R0402_10K_1%_0.0625W_100PPM: Resistor - 1%; Part Description: General Purpose Thick Film Chip Resistor; Manufacturer: GENERIC; Manufacturer1 Part Number: 232270671003L; TC: ±100ppm/°C; PressFit: No; Part Number: R0402_10K_1%_0.0625W_100PPM; Component Kind: Standard; Component Type: Standard; Pin Count: 2; Value: 10k; Status: Not Recommended; Power: 0.0625W; Tolerance: ±1%; Manufacturer Part Number: R0402_10K_1%_0.0625W_100PPM; Case: 0402; Mounted: Yes; Sense: No; Socket: No; SMD: Yes; Manufacturer1 Example: YAGEO PHYCOMP; Manufacturer1 ComponentHeight: 0.4mm; HelpURL: \\cern.ch\dfs\Applications\Altium\Datasheets\R0402_Phycomp_RC0402.pdf; Author: CERN DEM JLC; CreateDate: 03.12.2007; LatestRevisionDate: 17.10.2012
R142 R143 R216 R220 = R0402_240R_1%_0.0625W_100PPM: Resistor - 1%; Part Description: General Purpose Thick Film Chip Resistor; Manufacturer: GENERIC; Manufacturer1 Part Number: 232270672401L; TC: ±100ppm/°C; PressFit: No; Part Number: R0402_240R_1%_0.0625W_100PPM; Component Kind: Standard; Component Type: Standard; Pin Count: 2; Value: 240; Status: Not Recommended; Power: 0.0625W; Tolerance: ±1%; Manufacturer Part Number: R0402_240R_1%_0.0625W_100PPM; Case: 0402; Mounted: Yes; Sense: No; Socket: No; SMD: Yes; Manufacturer1 Example: YAGEO PHYCOMP; Manufacturer1 ComponentHeight: 0.4mm; HelpURL: \\cern.ch\dfs\Applications\Altium\Datasheets\R0402_Phycomp_RC0402.pdf; Author: CERN DEM JLC; CreateDate: 03.12.2007; LatestRevisionDate: 17.10.2012
T11 T16-T18 = BSH103: N-CHANNEL MOSFET WITH DIODE; Part Description: 30V 850mA N-Channel Enhancement Mode Field-Effect Transistor; Manufacturer: NEXPERIA; PressFit: No; Bonding: No; Part Number: BSH103; Component Kind: Standard; Component Type: Standard; Device: BSH103; PackageDescription: SOT23, 3 pin, Pitch 0.95mm - 1.3mm W X 2.9mm L X 1.1mm H, IPC Medium Density; Manufacturer Part Number: BSH103; Pin Count: 3; Case: SOT23-3; Mounted: Yes; Socket: No; SMD: Yes; Sense: No; ComponentHeight: 1.1mm; HelpURL: \\cern.ch\dfs\Applications\Altium\Datasheets\BSH103.pdf; Author: CERN DEM JLC; CreateDate: 16.03.2010; LatestRevisionDate: 20.06.2017